# EAGLE design LifterPCB_v9 (EAGLE 9.7.0)
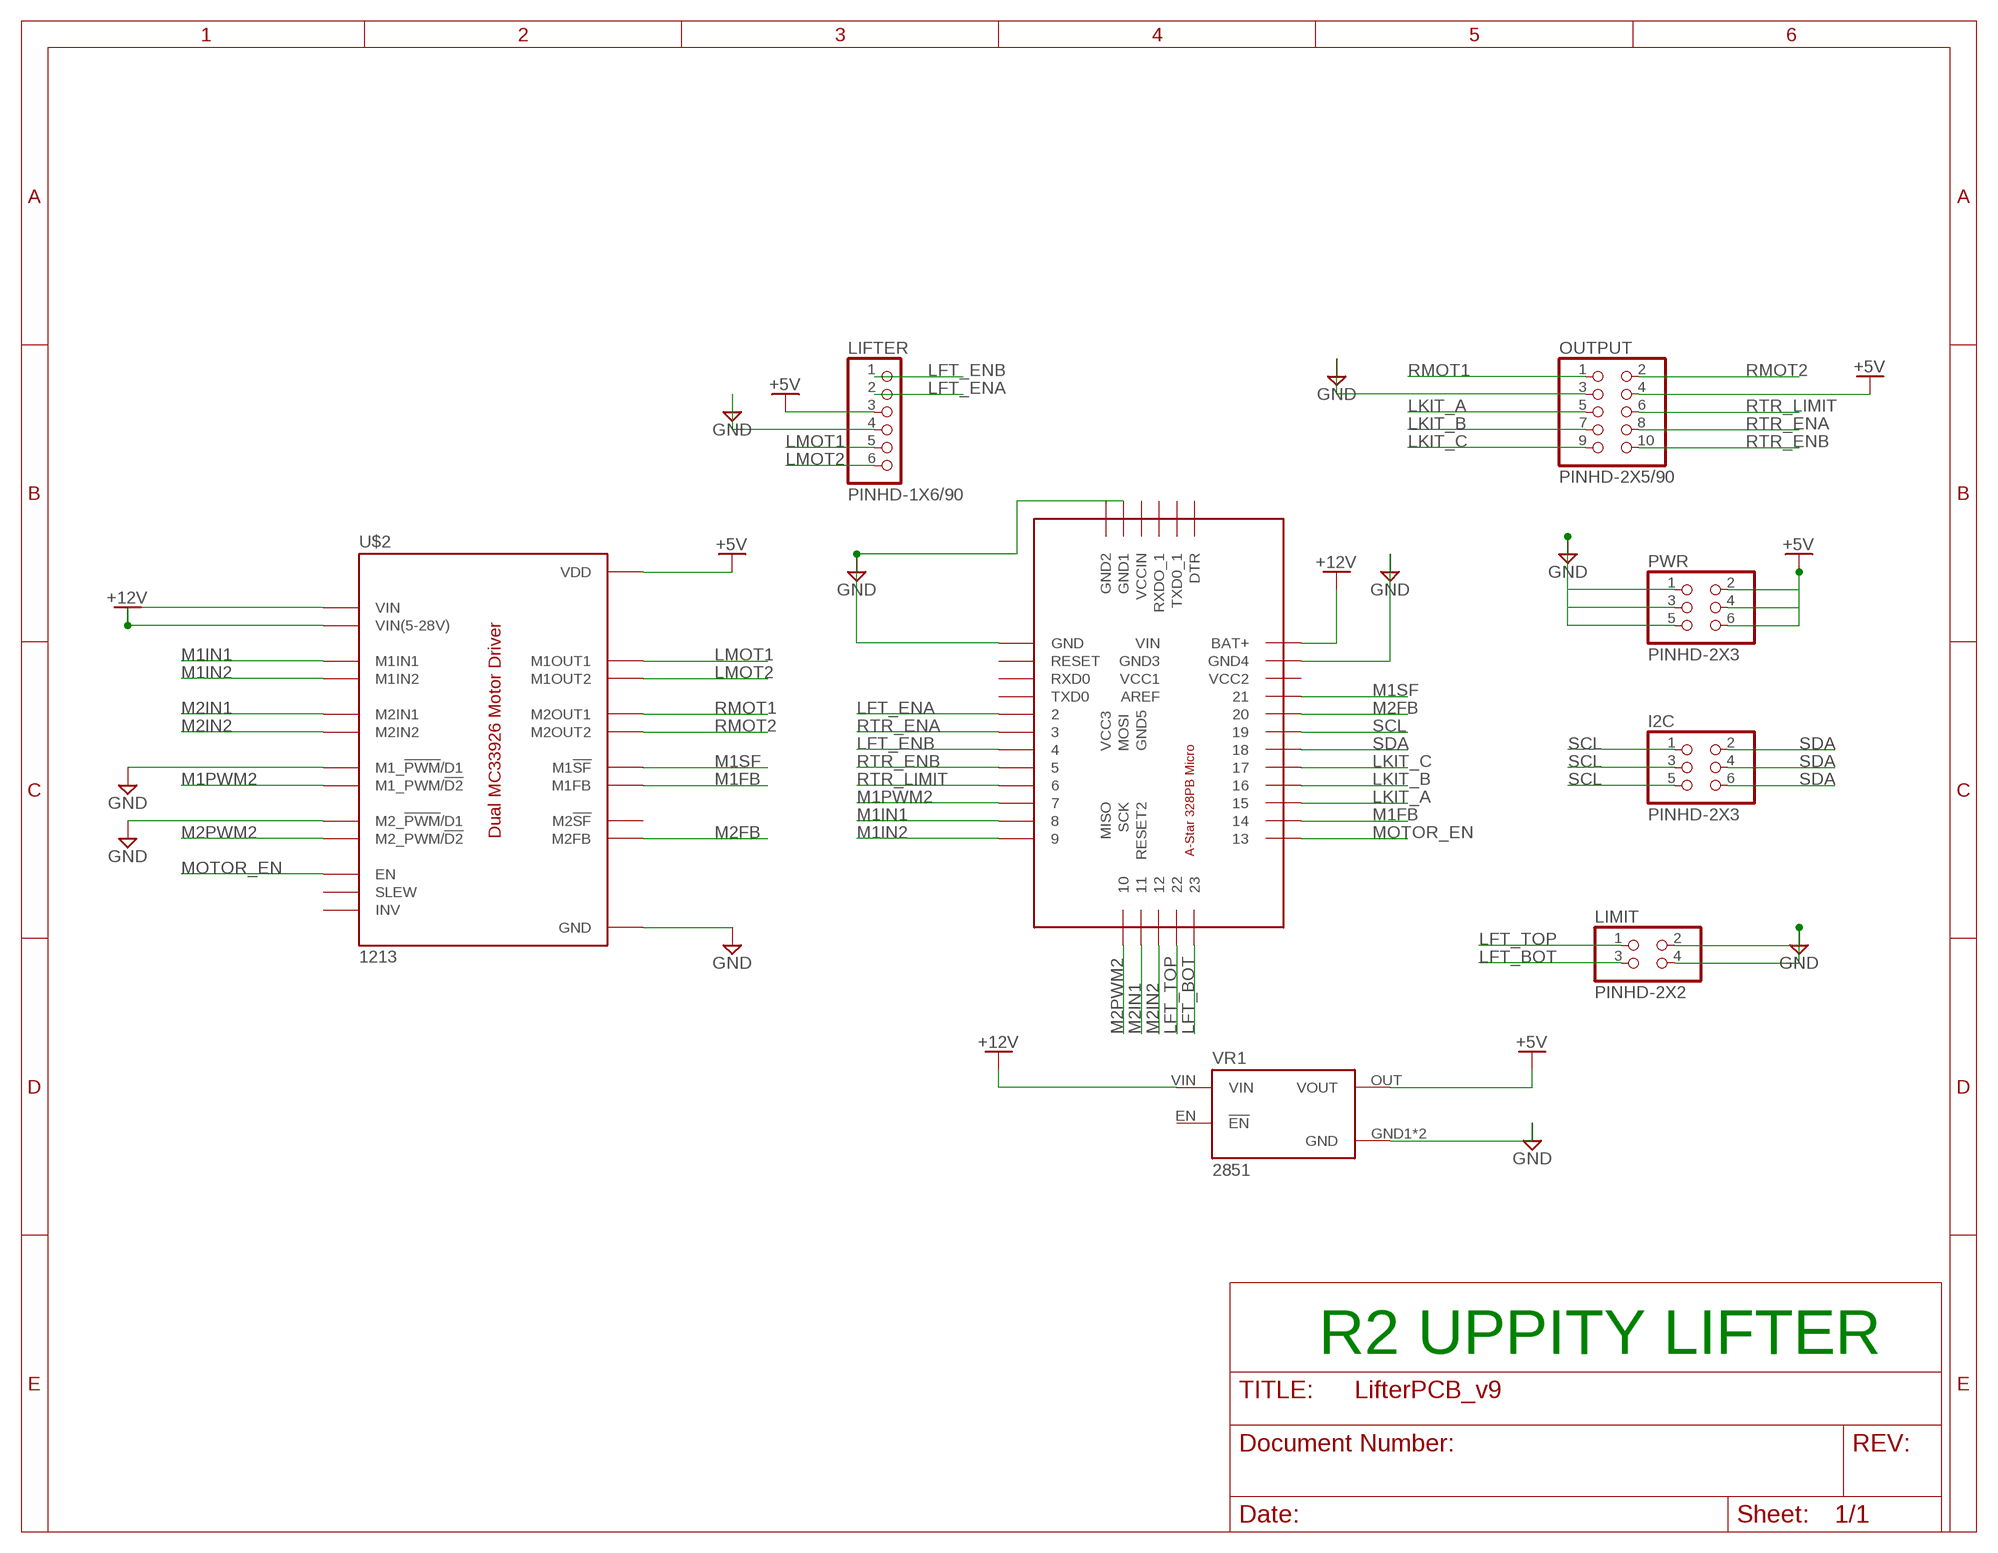
[diagram p0: schematic, sheet 1]

## Parts
I2C  PINHD-2X3  [2X03]
LIFTER  PINHD-1X6/90  [1X06/90]
LIMIT  PINHD-2X2  [2X02]
OUTPUT  PINHD-2X5/90  [2X05/90]
PWR  PINHD-2X3  [2X03]
U$1  POLOLU3161  [POLOLU3161]
U$2  1213  [1213]
VR1  2851  [VREG_2851]

## Nets
+5V [power]: LIFTER.3 OUTPUT.4 PWR.2 PWR.4 PWR.6 U$2.VDD U$2.VDD$1(VDD) U$2.VDD$2(VDD) U$2.VDD$3(VDD) U$2.VDD$4(VDD) U$2.VDD$5(VDD) VR1.OUT(VOUT)
+12V [power]: U$1.BAT+ U$2.MVIN(VIN(5-28V)) U$2.VIN VR1.VIN
GND: LIFTER.4 LIMIT.2 LIMIT.4 OUTPUT.3 PWR.1 PWR.3 PWR.5 U$1.GND2(GND4) U$1.GND4(GND2) U$1.GND5(GND1) U$1.GND6(GND) U$2.GND U$2.GND$1(GND) U$2.GND$2(GND) U$2.M1PWM1(M1_!PWM!/D1) U$2.M2PWM1(M2_!PWM!/D1) U$2.MGND(GND) VR1.GND1(GND) VR1.GND2(GND)
LFT_BOT: LIMIT.3 U$1.23
LFT_ENA: LIFTER.2 U$1.2
LFT_ENB: LIFTER.1 U$1.4
LFT_TOP: LIMIT.1 U$1.22
LKIT_A: OUTPUT.5 U$1.15
LKIT_B: OUTPUT.7 U$1.16
LKIT_C: OUTPUT.9 U$1.17
LMOT1: LIFTER.5 U$2.M1OUT1
LMOT2: LIFTER.6 U$2.M1OUT2
M1FB: U$1.14 U$2.M1FB
M1IN1: U$1.8 U$2.M1IN1
M1IN2: U$1.9 U$2.M1IN2
M1PWM2: U$1.7 U$2.M1PWM2(M1_PWM/!D2)
M1SF: U$1.21 U$2.M1SF(M1!SF)
M2FB: U$1.20 U$2.M2FB
M2IN1: U$1.11$1 U$2.M2IN1
M2IN2: U$1.12$1 U$2.M2IN2
M2PWM2: U$1.10 U$2.M2PWM2(M2_PWM/!D2)
MOTOR_EN: U$1.13$1 U$2.EN
RMOT1: OUTPUT.1 U$2.M2OUT1
RMOT2: OUTPUT.2 U$2.M2OUT2
RTR_ENA: OUTPUT.8 U$1.3
RTR_ENB: OUTPUT.10 U$1.5
RTR_LIMIT: OUTPUT.6 U$1.6
SCL: I2C.1 I2C.3 I2C.5 U$1.19
SDA: I2C.2 I2C.4 I2C.6 U$1.18
Unconnected: U$1.11$2(MOSI) U$1.12$2(MISO) U$1.13$2(SCK) U$1.AREF U$1.DTR U$1.GND1(GND5) U$1.GND3 U$1.RESET1(RESET2) U$1.RESET2(RESET) U$1.RXD0_1(RXD0) U$1.RXD0_2(RXDO_1) U$1.TXD0_1(TXD0) U$1.TXD0_2(TXD0_1) U$1.VCC1 U$1.VCC2 U$1.VCC3 U$1.VCCIN U$1.VIN U$2.INV U$2.M2SF(M2!SF) U$2.SLEW VR1.EN(!EN)

## Notes on the sheet
- R2 UPPITY LIFTER

## Library data of the parts
I2C PWR = Connector:PINHD-2X3: PIN HEADER; CATEGORY: CONNECTOR; SUB-CATEGORY: PIN-HEADER
LIFTER = Connector:PINHD-1X6: PIN HEADER; CATEGORY: CONNECTOR; SUB-CATEGORY: PIN-HEADER
LIMIT = Connector:PINHD-2X2: PIN HEADER; CATEGORY: CONNECTOR; SUB-CATEGORY: PIN-HEADER
OUTPUT = Connector:PINHD-2X5: PIN HEADER; CATEGORY: CONNECTOR; SUB-CATEGORY: PIN-HEADER
U$1 = Pololu:POLOLU3161
U$2 = Pololu:1213
VR1 = 2851:2851: Description: Pololu 5V, 5A Step-Down Voltage Regulator D24V50F5 Check prices <https://pricing.snapeda.com/parts/2851/Pololu/view-part?ref=eda>; AVAILABILITY: Bad; DESCRIPTION: Description: Pololu 5V, 5A Step-Down Voltage Regulator D24V50F5; MF: Pololu; MP: 2851; PACKAGE: Package; PRICE: None; PURCHASE-URL: https://pricing.snapeda.com/search/part/2851/?ref=eda

## Net classes
0 default: width 0.203 mm
1 power: width 0.508 mm

## Board
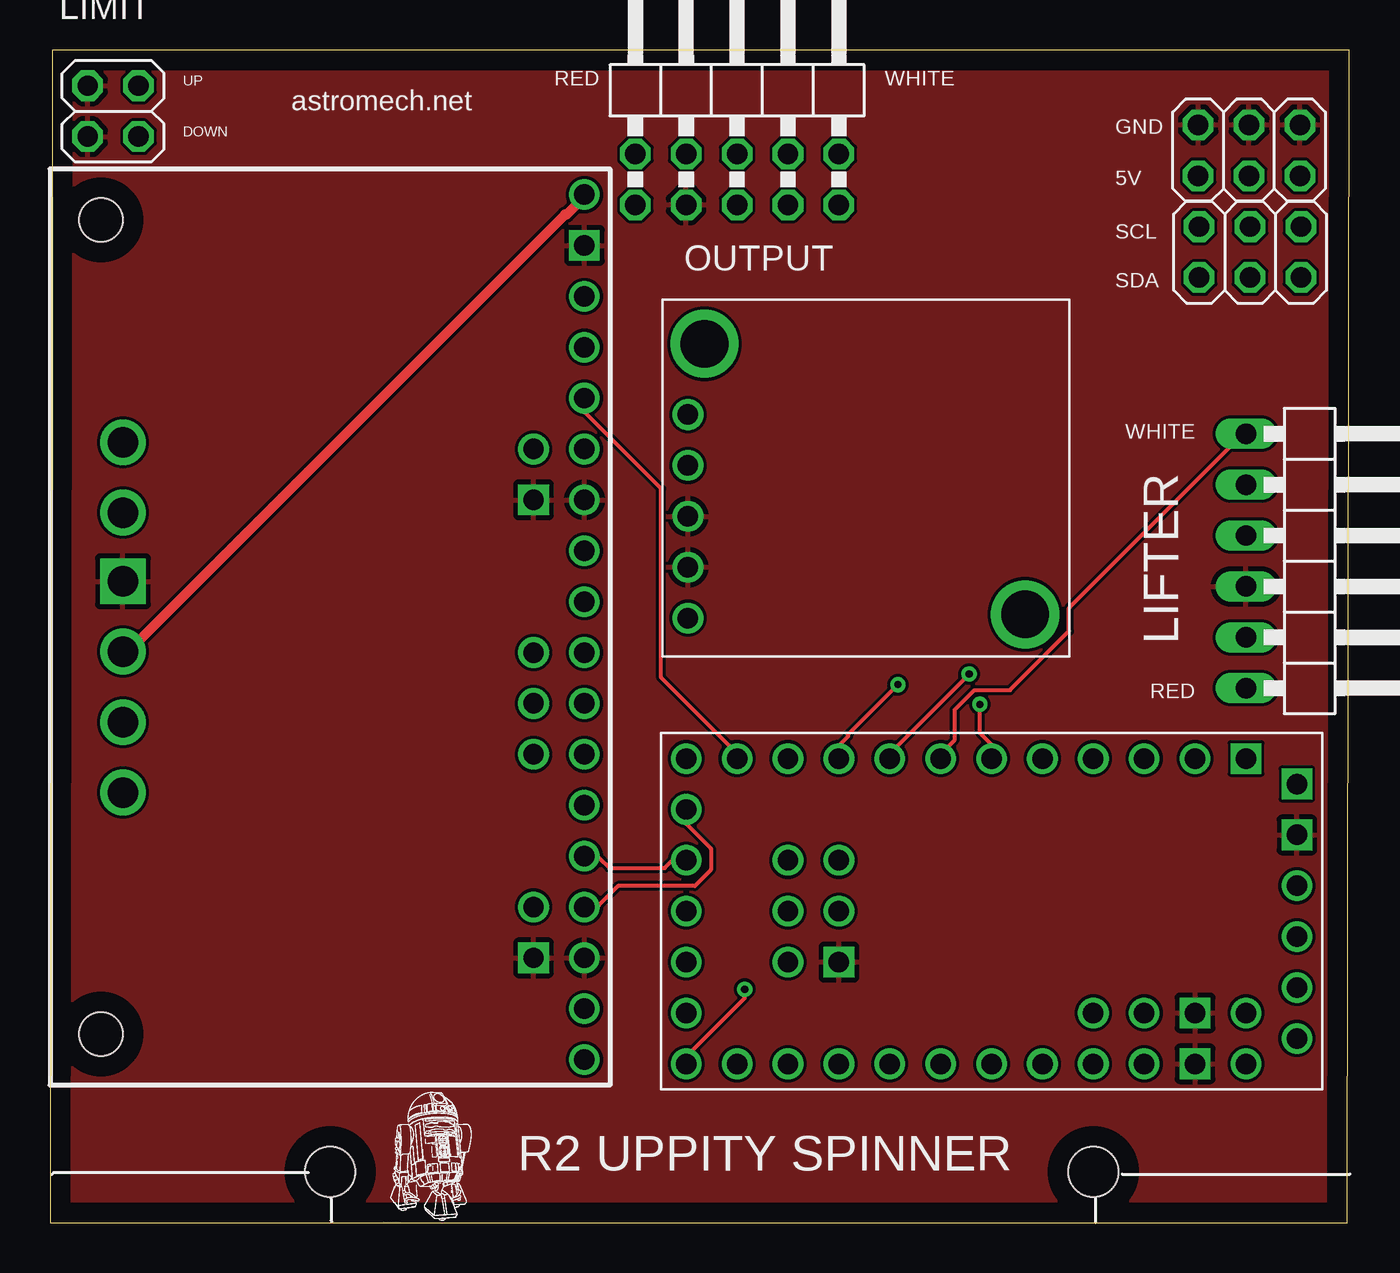
[diagram p1: board, top side]
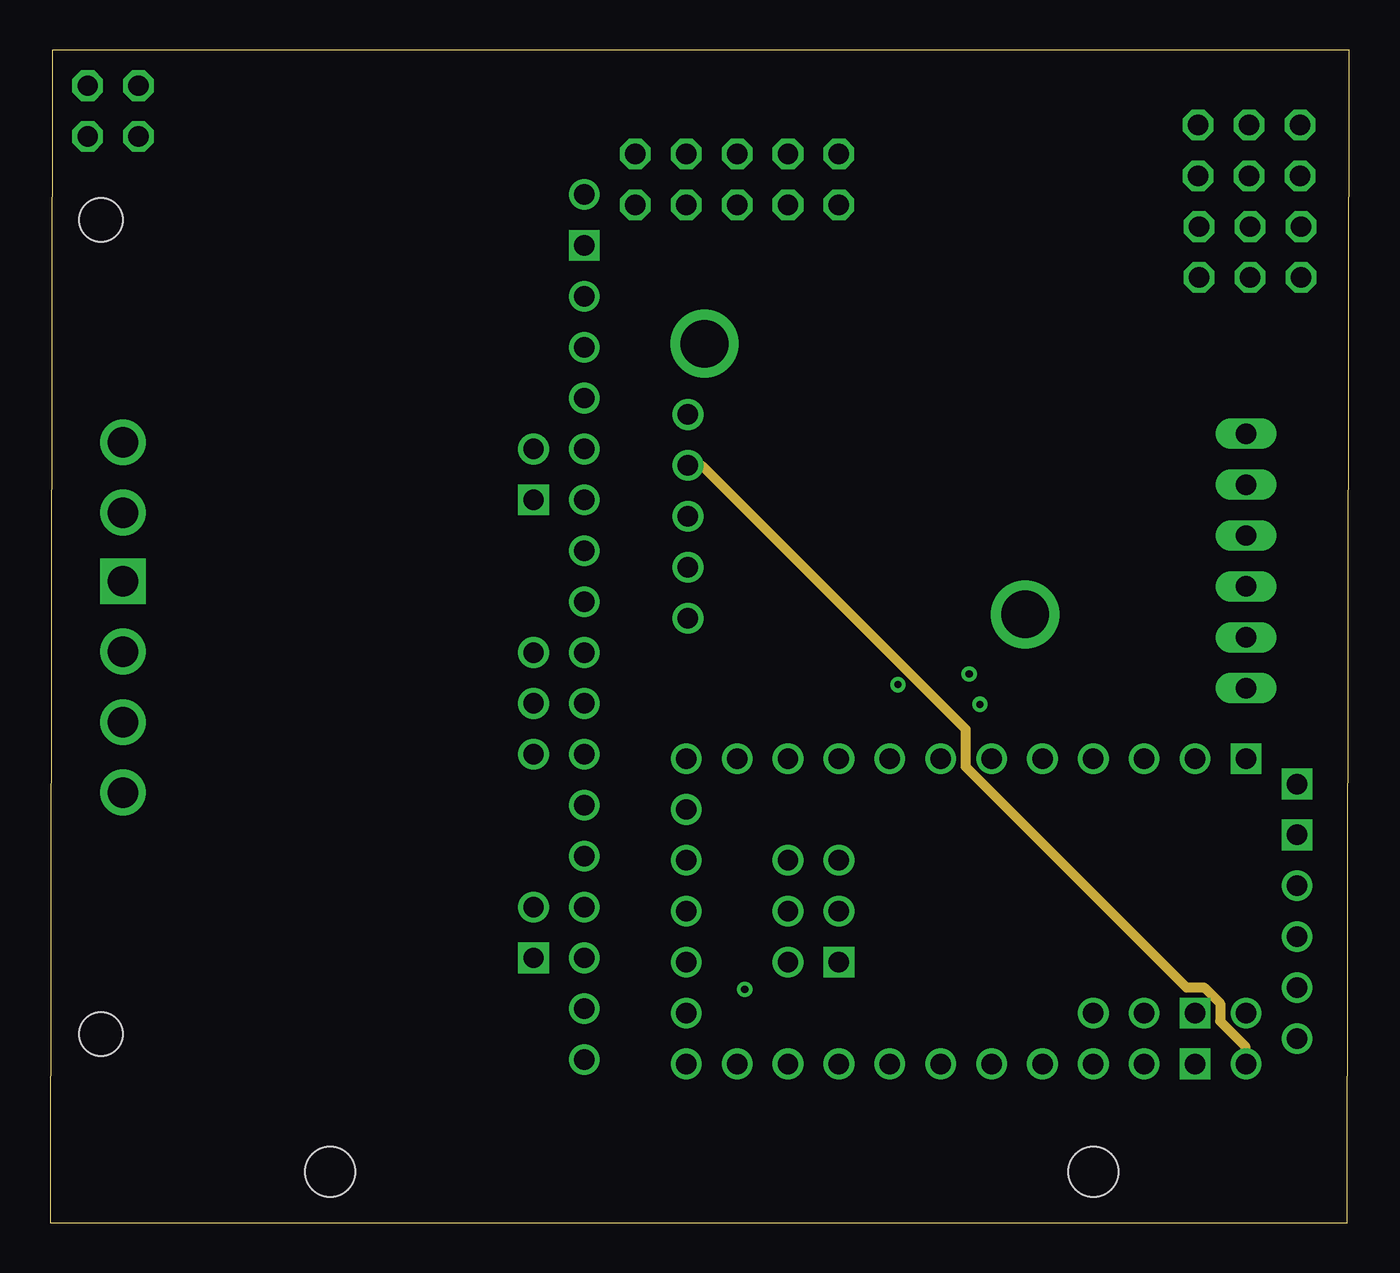
[diagram p2: board, inner layer Route2]
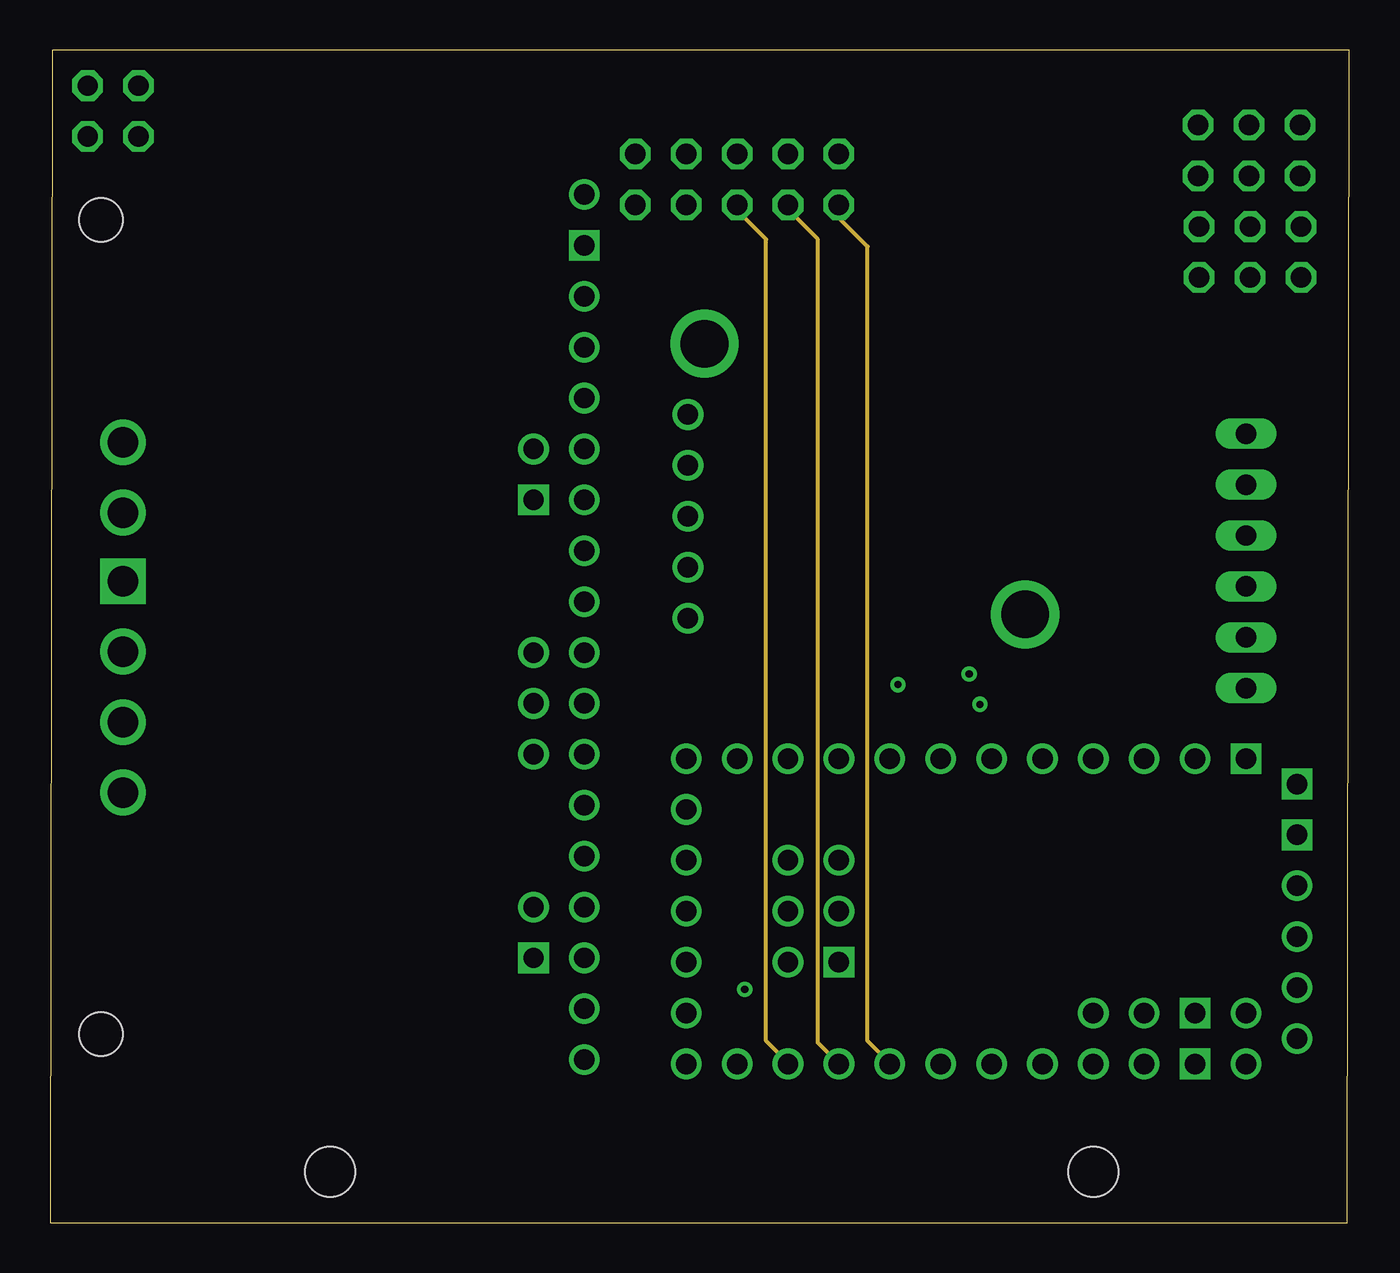
[diagram p3: board, inner layer Route15]
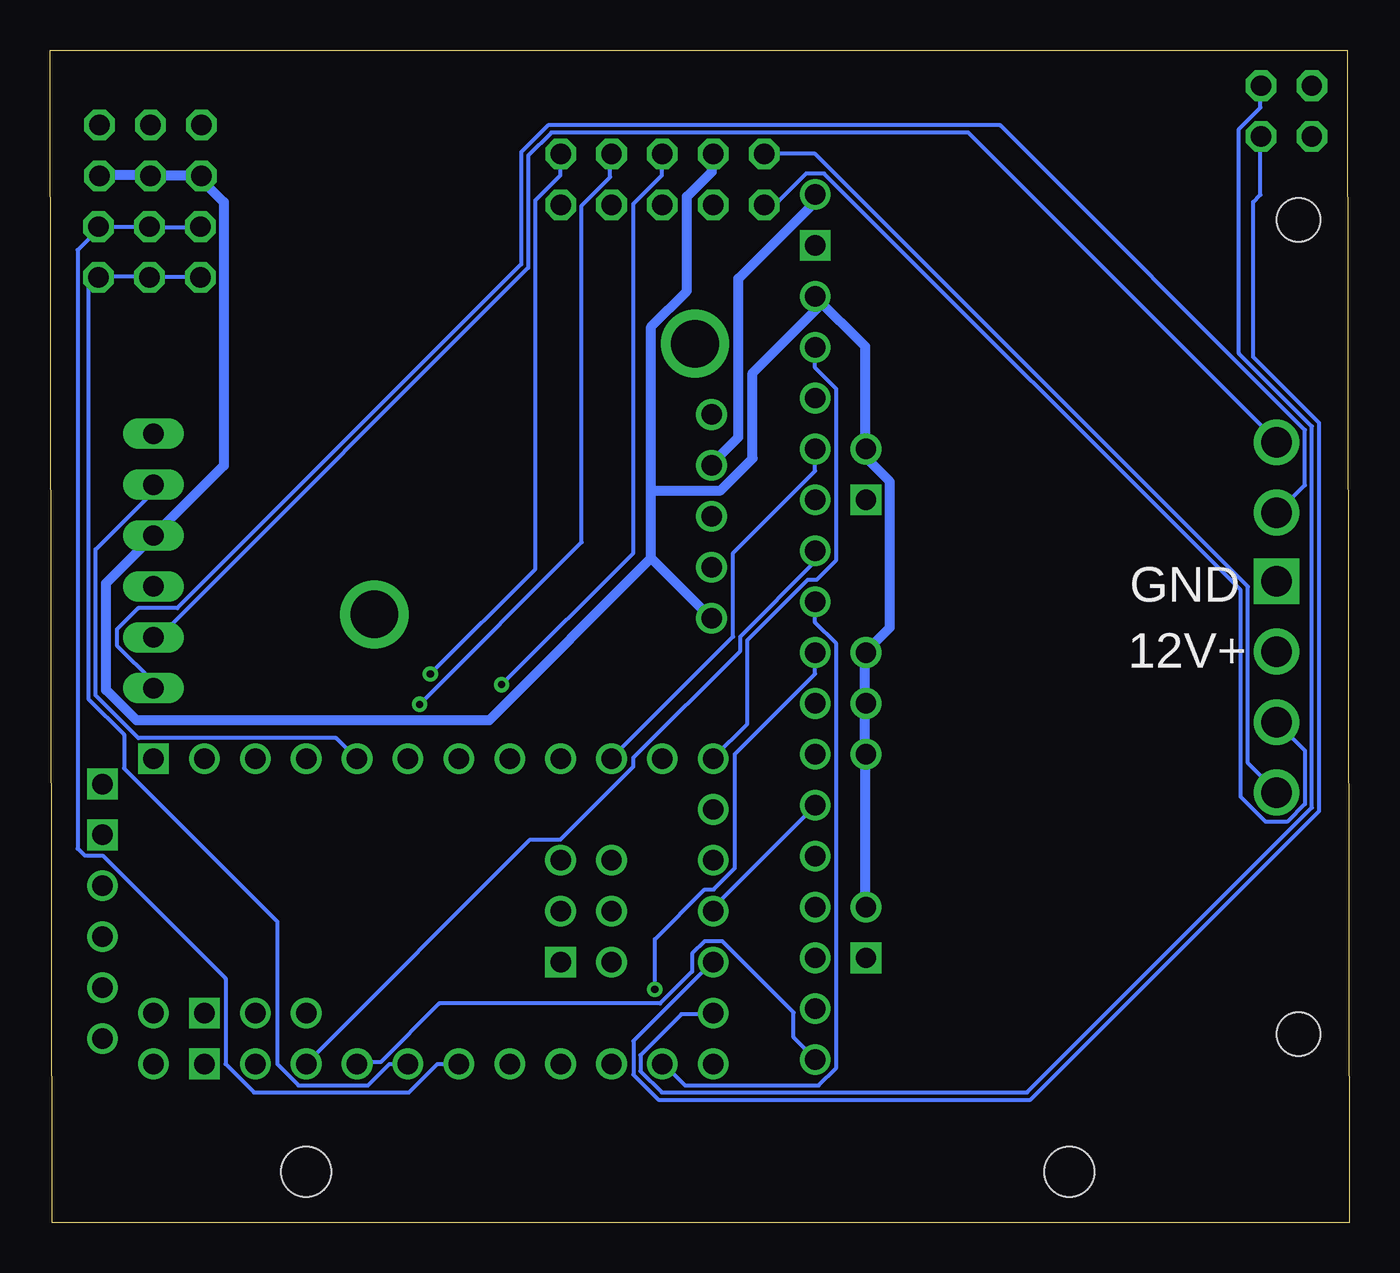
[diagram p4: board, bottom side, seen from below]

Size 64.85 x 58.52 mm. Coordinates in mm from the lower left corner, seen from the top.
Outline: 0,0 64.75,0 64.85,58.52 0.1,58.52 0,0
Copper layers (1+2*15+16): Top 0.035mm / dielectric 1.5mm / Route2 0.035mm / dielectric 0.15mm / Route15 0.035mm / dielectric 0.2mm / Bottom 0.035mm
Design rules "default *": minimum track width 6mil, minimum drill 0.35mm, track to track 6mil, track to pad 6mil, pad to pad 6mil, via to via 6mil, smd to smd 6mil, copper to edge 40mil, drill to drill 6mil, minimum pad ring 10mil, minimum via ring 8mil, stop-mask expansion 4mil, vias tented up to drill 0mil, thermal gap 10mil
Holes 2.5 mm at 13.97,2.54 52.07,2.54

### Footprints (pad centres in the part's own frame; a part is rotated, then mirrored left to right if it is on the bottom)
2X03 = drill 1.016 octagon: 1 -2.54,-1.27; 2 -2.54,1.27; 3 0,-1.27; 4 0,1.27; 5 2.54,-1.27; 6 2.54,1.27
1X06/90 = drill 1.016 long: 1 -6.35,-3.81; 2 -3.81,-3.81; 3 -1.27,-3.81; 4 1.27,-3.81; 5 3.81,-3.81; 6 6.35,-3.81
2X02 = drill 1.016 octagon: 1 -1.27,-1.27; 2 -1.27,1.27; 3 1.27,-1.27; 4 1.27,1.27
2X05/90 = drill 1.016 octagon: 1 -5.08,-6.35; 2 -5.08,-3.81; 3 -2.54,-6.35; 4 -2.54,-3.81; 5 0,-6.35; 6 0,-3.81; 7 2.54,-6.35; 8 2.54,-3.81; 9 5.08,-6.35; 10 5.08,-3.81
POLOLU3161 = drill 1.02: 2 -7.62,1.27; 3 -7.62,-1.27; 4 -7.62,-3.81; 5 -7.62,-6.35; 6 -7.62,-8.89; 7 -7.62,-11.43; 8 -7.62,-13.97; 9 -7.62,-16.51; 10 -5.08,-16.51; 11$1 -2.54,-16.51; 11$2 0,-8.89; 12$1 0,-16.51; 12$2 -2.54,-11.43; 13$1 7.62,-16.51; 13$2 0,-11.43; 14 7.62,-13.97; 15 7.62,-11.43; 16 7.62,-8.89; 17 7.62,-6.35; 18 7.62,-3.81; 19 7.62,-1.27; 20 7.62,1.27; 21 7.62,3.81; 22 2.54,-16.51; 23 5.08,-16.51; AREF 5.08,3.81; BAT+ 7.62,11.43; DTR 6.35,13.97; RESET1 -7.62,8.89; RESET2 2.54,-11.43; RXD0_1 1.27,13.97; RXD0_2 -7.62,6.35; TXD0_1 3.81,13.97; TXD0_2 -7.62,3.81; VCC1 5.08,6.35; VCC2 7.62,6.35; VCC3 -2.54,-8.89; VCCIN -1.27,13.97; VIN 5.08,11.43 | drill 1.02 square: GND1 -6.35,13.97; GND2 -3.81,13.97; GND3 -7.62,11.43; GND4 5.08,8.89; GND5 7.62,8.89; GND6 2.54,-8.89
1213 = drill 1.02: EN -12.7,1.27; INV -12.7,6.35; M1FB -12.7,-1.27; M1IN1 -12.7,-11.43; M1IN2 -12.7,-13.97; M1PWM1 -12.7,-6.35; M1PWM2 -12.7,-8.89; M1SF -12.7,-3.81; M2FB -12.7,21.59; M2IN1 -12.7,11.43; M2IN2 -12.7,8.89; M2PWM1 -12.7,16.51; M2PWM2 -12.7,13.97; M2SF -12.7,19.05; SLEW -12.7,3.81; VDD -12.7,-16.51; VDD$1 -10.16,13.97; VDD$2 -10.16,6.35; VDD$3 -10.16,3.81; VDD$4 -10.16,1.27; VDD$5 -10.16,-8.89; VIN -12.7,-21.59 | drill 1.02 square: GND -12.7,-19.05; GND$1 -10.16,16.51; GND$2 -10.16,-6.35 | drill 1.52: M1OUT1 10.338,-9.22; M1OUT2 10.338,-5.715; M2OUT1 10.338,4.75; M2OUT2 10.338,8.255; MVIN 10.338,1.219 | drill 1.52 square: MGND 10.338,-2.286 | hole 2.18: 11.43,20.32; 11.43,-20.32
VREG_2851 = drill 1.02: EN -8.88,3.17; GND1 -8.88,-1.91; GND2 -8.88,-4.45; OUT -8.88,-6.99; VIN -8.88,0.63 | drill 2.38: P1 -8.05,6.7; P2 7.95,-6.8

### Placement (x,y rotation side)
I2C  59.89,48.44 0 top
LIFTER  63.5,33.02 270 top
LIMIT  3.15,55.47 90 top
OUTPUT  34.29,57.15 0 top
PWR  59.84,53.52 180 top
U$1  48.26,15.54 270 top
U$2  13.97,29.72 180 top
VR1  40.72,37.16 0 top

### Tracks (layer width: path | path; a pad name or v marks a point on that pad's centre or on a via)
+5V
  Bottom 0.508: U$2.VDD$1 24.18,15.82 24.18,23.29 U$2.VDD$2 24.18,23.56 24.18,25.87 U$2.VDD$3 24.18,26.14 24.18,28.45 U$2.VDD$4 24,28.63 22.94,29.69 22.94,36.98 24,38.05 24,38.41 U$2.VDD$5 24.18,38.67 24.18,43.74 U$2.VDD 26.49,45.7 29.78,42.41 29.78,38.14 31.38,36.54 34.85,36.54 | PWR.2 62.32,52.27 60.1,52.27 PWR.4 59.83,52.27 57.34,52.27 PWR.6 57.25,52.01 56.19,50.94 56.19,37.78 59.65,34.31 LIFTER.3 59.83,34.14 62.05,31.91 62.05,26.58 60.54,25.07 42.94,25.07 34.85,33.16 | 34.85,33.16 34.85,36.54 | 34.85,36.54 34.85,44.72 33.07,46.49 33.07,51.21 31.83,52.45 31.83,53.34 OUTPUT.4 | 34.85,33.16 31.91,30.23 VR1.OUT
+12V
  Top 0.508: U$2.VIN 26.67,51.21 25.78,50.32 25.69,50.32 3.91,28.54 3.65,28.54 U$2.MVIN
  Route2 0.508: U$1.BAT+ 59.65,8 59.65,8.8 58.41,10.05 58.41,10.94 57.61,11.73 56.72,11.73 45.7,22.76 45.7,24.62 32.54,37.78 31.91,37.78 VR1.VIN
  Bottom 0.508: U$2.VIN 26.67,50.94 30.49,47.12 30.49,39.2 31.83,37.87 VR1.VIN
GND
  pour Top: 0.34,0.34 0.37,0.36 64.48,0.36 64.64,0.51 64.64,58.29 0.23,58.29 0.25,0.26
LFT_BOT
  Bottom 0.203: LIMIT.3 4.45,56.72 4.45,55.65 5.51,54.59 5.51,43.38 1.87,39.74 1.87,20.71 16.09,6.49 34.31,6.49 35.38,7.56 35.38,8.36 33.34,10.4 31.83,10.4 U$1.23
LFT_ENA
  Bottom 0.203: LIFTER.2 59.74,36.8 59.74,36.45 62.59,33.6 62.59,26.31 60.45,24.18 50.58,24.18 49.61,23.2 U$1.2
LFT_ENB
  Top 0.203: U$1.4 44.45,23.38 45.16,24.09 45.16,25.6 46.14,26.58 47.92,26.58 50.85,29.52 50.85,30.67 59.47,39.29 59.65,39.29 LIFTER.1
LFT_TOP
  Bottom 0.203: LIMIT.1 4.45,54.14 4.45,51.3 4.8,50.94 4.8,43.2 1.51,39.92 1.51,20.54 15.91,6.13 34.49,6.13 35.74,7.38 35.74,9.07 31.83,12.98 U$1.22
LKIT_A
  Route15 0.203: OUTPUT.5 34.31,50.76 34.31,50.49 35.74,49.07 35.74,9.07 36.8,8 U$1.15
LKIT_B
  Route15 0.203: OUTPUT.7 36.89,50.76 36.89,50.49 38.32,49.07 38.32,8.98 39.29,8 U$1.16
LKIT_C
  Route15 0.203: OUTPUT.9 39.38,50.76 39.38,50.14 40.8,48.72 40.8,9.07 41.87,8 U$1.17
LMOT1
  Bottom 0.203: LIFTER.5 59.65,29.25 59.38,29.25 40.98,47.65 40.98,53.25 39.83,54.41 19.02,54.41 3.65,39.03 U$2.M1OUT1
LMOT2
  Bottom 0.203: LIFTER.6 59.74,26.67 59.74,27.03 61.52,28.8 61.52,29.6 60.45,30.67 58.5,30.67 41.34,47.83 41.34,53.43 40.01,54.76 17.42,54.76 2.22,39.56 2.22,36.8 3.56,35.47 U$2.M1OUT2
M1FB
  Bottom 0.203: U$2.M1FB 26.67,29.96 25.6,28.89 25.6,7.73 26.49,6.84 33.16,6.84 34.23,7.91 U$1.14
M1IN1
  Top 0.203: U$2.M1IN1 26.67,40.45 30.49,36.63 30.49,27.2 34.23,23.47 34.23,23.2 U$1.8
M1IN2
  Bottom 0.203: U$2.M1IN2 26.67,42.67 25.6,41.6 25.6,33.07 26.58,32.09 27.03,32.09 30.05,29.07 30.05,24.89 31.74,23.2 U$1.9
M1PWM2
  Bottom 0.203: U$2.M1PWM2 26.67,37.52 30.76,33.43 30.76,29.25 36.8,23.2 U$1.7
M1SF
  Bottom 0.203: U$2.M1SF 26.67,32.98 30.4,29.25 30.4,28.54 35.74,23.2 35.74,22.76 39.38,19.11 40.89,19.11 52.01,8 U$1.21
M2FB
  Bottom 0.203: U$1.20 49.52,8 48.36,8 45.43,10.94 34.4,10.94 32.8,12.54 32.8,13.42 32.18,14.05 31.29,14.05 27.74,10.49 27.74,9.25 26.67,8.18 U$2.M2FB
M2IN1
  Top 0.203: U$1.11$1 31.74,18.05 31.03,18.05 30.67,17.69 27.91,17.69 27.38,18.22 26.67,18.22 U$2.M2IN1
M2IN2
  Bottom 0.203: U$1.12$1 31.74,15.56 31.74,15.73 26.67,20.8 U$2.M2IN2
M2PWM2
  Top 0.203: U$2.M2PWM2 26.67,15.82 27.38,15.82 28.36,16.8 32.18,16.8 32.98,17.6 32.98,18.67 31.74,19.91 31.74,20.54 U$1.10
MOTOR_EN  (via drill 0.35)
  Top 0.203: v34.67,11.65 34.67,11.2 31.83,8.36 31.83,8 U$1.13$1
  Bottom 0.203: U$2.EN 26.67,27.38 30.67,23.38 30.67,17.69 31.74,16.62 32.18,16.62 34.67,14.13 v34.67,11.65
RMOT1
  Bottom 0.203: OUTPUT.1 29.16,50.85 28.63,50.85 27.11,52.36 26.23,52.36 5.42,31.56 5.42,21.25 4.18,20 3.11,20 2.22,20.89 2.22,23.56 3.56,24.89 U$2.M2OUT1
RMOT2
  Bottom 0.203: OUTPUT.2 26.67,53.34 5.07,31.74 5.07,22.94 3.65,21.51 U$2.M2OUT2
RTR_ENA  (via drill 0.35)
  Top 0.203: v46.41,25.87 46.41,24.45 47.03,23.82 47.03,23.2 U$1.3
  Bottom 0.203: v46.41,25.87 38.32,33.96 38.32,50.76 36.89,52.18 36.89,53.34 OUTPUT.8
RTR_ENB  (via drill 0.35)
  Top 0.203: v45.87,27.38 41.96,23.47 41.96,23.2 U$1.5
  Bottom 0.203: v45.87,27.38 40.63,32.63 40.63,51.03 39.38,52.27 39.38,53.34 OUTPUT.10
RTR_LIMIT  (via drill 0.35)
  Top 0.203: v42.32,26.85 39.83,24.36 39.83,24.27 39.38,23.82 39.38,23.2 U$1.6
  Bottom 0.203: v42.32,26.85 35.74,33.43 35.74,50.85 34.31,52.27 34.31,53.34 OUTPUT.6
SCL
  Bottom 0.203: I2C.1 57.43,47.21 59.83,47.21 I2C.3 59.92,47.21 62.41,47.21 I2C.5 62.5,47.12 62.94,46.67 62.94,26.14 61.16,24.36 61.16,22.67 53.52,15.02 53.52,7.91 52.45,6.84 48.98,6.84 47.92,7.91 47.03,7.91 U$1.19
SDA
  Bottom 0.203: I2C.2 57.43,49.7 59.83,49.7 I2C.4 59.92,49.7 62.41,49.7 I2C.6 62.41,49.61 63.48,48.54 63.48,18.67 63.12,18.31 62.23,18.31 56.1,12.18 56.1,7.91 54.67,6.49 46.94,6.49 45.52,7.91 U$1.18

### Text on the board
tPlace: R2 UPPITY SPINNER | /Users/mimir/r2d2.bmp
tNames: UP | RED | WHITE | astromech.net | DOWN | GND | 5V | SCL | SDA | WHITE | RED
bNames: GND | 12V+